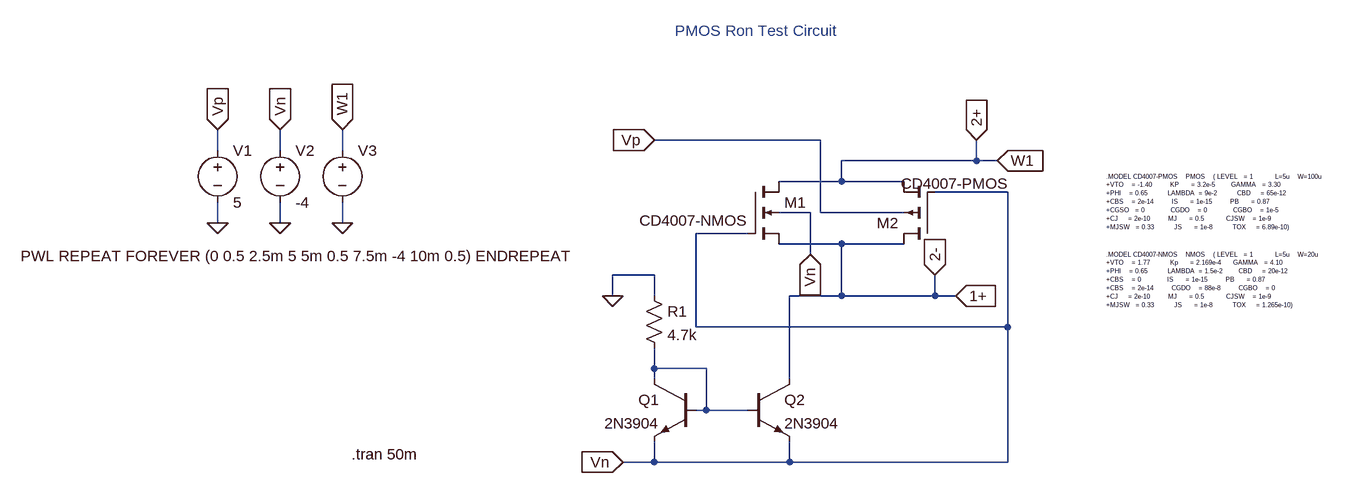
[diagram p0: schematic pmos_ron_test_ltspice.asc]
pmos_ron_test_ltspice.asc, the LTspice schematic file:
Version 4
SHEET 1 1696 680
WIRE 336 -1280 80 -1280
WIRE -592 -1264 -592 -1296
WIRE -496 -1264 -496 -1296
WIRE -400 -1264 -400 -1296
WIRE 576 -1248 576 -1280
WIRE 576 -1248 368 -1248
WIRE 608 -1248 576 -1248
WIRE 368 -1216 368 -1248
WIRE 368 -1216 272 -1216
WIRE 464 -1216 368 -1216
WIRE 624 -1200 512 -1200
WIRE 320 -1168 272 -1168
WIRE 336 -1168 336 -1280
WIRE 464 -1168 336 -1168
WIRE -592 -1152 -592 -1184
WIRE -496 -1152 -496 -1184
WIRE -400 -1152 -400 -1184
WIRE 224 -1136 144 -1136
WIRE 368 -1120 272 -1120
WIRE 464 -1120 368 -1120
WIRE 320 -1104 320 -1168
WIRE 80 -1072 16 -1072
WIRE 16 -1040 16 -1072
WIRE 80 -1040 80 -1072
WIRE 368 -1040 368 -1120
WIRE 368 -1040 288 -1040
WIRE 512 -1040 512 -1072
WIRE 512 -1040 368 -1040
WIRE 544 -1040 512 -1040
WIRE 144 -992 144 -1136
WIRE 624 -992 624 -1200
WIRE 624 -992 144 -992
WIRE 80 -928 80 -960
WIRE 160 -928 80 -928
WIRE 80 -912 80 -928
WIRE 288 -912 288 -1040
WIRE 160 -864 160 -928
WIRE 160 -864 144 -864
WIRE 224 -864 160 -864
WIRE 80 -784 80 -816
WIRE 80 -784 32 -784
WIRE 288 -784 288 -816
WIRE 288 -784 80 -784
WIRE 624 -784 624 -992
WIRE 624 -784 288 -784
FLAG 16 -1040 0
FLAG 80 -1280 Vp
IOPIN 80 -1280 In
FLAG 32 -784 Vn
IOPIN 32 -784 In
FLAG 512 -1072 2-
IOPIN 512 -1072 In
FLAG 544 -1040 1+
IOPIN 544 -1040 In
FLAG 608 -1248 W1
IOPIN 608 -1248 In
FLAG 576 -1280 2+
IOPIN 576 -1280 In
FLAG -592 -1152 0
FLAG -496 -1152 0
FLAG -400 -1152 0
FLAG -592 -1296 Vp
IOPIN -592 -1296 In
FLAG -496 -1296 Vn
IOPIN -496 -1296 In
FLAG -400 -1296 W1
IOPIN -400 -1296 In
FLAG 320 -1104 Vn
IOPIN 320 -1104 In
SYMBOL npn 144 -912 M0
SYMATTR InstName Q1
SYMATTR Value 2N3904
SYMBOL npn 224 -912 R0
SYMATTR InstName Q2
SYMATTR Value 2N3904
SYMBOL res 64 -1056 R0
SYMATTR InstName R1
SYMATTR Value 4.7k
SYMBOL voltage -592 -1280 R0
WINDOW 123 0 0 Left 0
WINDOW 39 0 0 Left 0
SYMATTR InstName V1
SYMATTR Value 5
SYMBOL voltage -496 -1280 R0
WINDOW 123 0 0 Left 0
WINDOW 39 0 0 Left 0
SYMATTR InstName V2
SYMATTR Value -4
SYMBOL voltage -400 -1280 R0
WINDOW 3 -495 179 Left 2
WINDOW 123 0 0 Left 0
WINDOW 39 0 0 Left 0
SYMATTR InstName V3
SYMATTR Value PWL REPEAT FOREVER (0 0.5 2.5m 5 5m 0.5 7.5m -4 10m 0.5) ENDREPEAT
SYMBOL nmos4 224 -1216 R0
WINDOW 3 -167 60 Left 2
SYMATTR InstName M1
SYMATTR Value CD4007-NMOS
SYMBOL pmos4 512 -1120 R180
WINDOW 3 -115 93 Left 2
SYMATTR InstName M2
SYMATTR Value CD4007-PMOS
TEXT 776 -1224 Left 0 !.MODEL CD4007-PMOS    PMOS    ( LEVEL   = 1           L=5u    W=100u                \n+VTO    = -1.40         KP      = 3.2e-5        GAMMA   = 3.30  \n+PHI    = 0.65          LAMBDA  = 9e-2          CBD     = 65e-12\n+CBS    = 2e-14         IS      = 1e-15         PB      = 0.87\n+CGSO   = 0             CGDO    = 0             CGBO    = 1e-5\n+CJ     = 2e-10         MJ      = 0.5           CJSW    = 1e-9\n+MJSW   = 0.33          JS      = 1e-8          TOX     = 6.89e-10)
TEXT 776 -1104 Left 0 !.MODEL CD4007-NMOS    NMOS    ( LEVEL   = 1           L=5u    W=20u             \n+VTO    = 1.77          Kp      = 2.169e-4      GAMMA   = 4.10  \n+PHI    = 0.65          LAMBDA  = 1.5e-2        CBD     = 20e-12\n+CBS    = 0             IS      = 1e-15         PB      = 0.87\n+CBS    = 2e-14         CGDO    = 88e-8         CGBO    = 0\n+CJ     = 2e-10         MJ      = 0.5           CJSW    = 1e-9\n+MJSW   = 0.33          JS      = 1e-8          TOX     = 1.265e-10)
TEXT 112 -1448 Left 2 ;PMOS Ron Test Circuit
TEXT -386 -796 Left 2 !.tran 50m

The netlist it stands for:
* pmos_ron_test_ltspice.asc
Q1 N001 N001 Vn 0 2N3904
Q2 1+ N001 Vn 0 2N3904
R1 0 N001 4.7k
V1 Vp 0 5
V2 Vn 0 -4
V3 2+ 0 PWL REPEAT FOREVER (0 0.5 2.5m 5 5m 0.5 7.5m -4 10m 0.5) ENDREPEAT
M1 2+ Vn 1+ Vn CD4007-NMOS
M2 1+ Vn 2+ Vp CD4007-PMOS
.model NPN NPN
.model PNP PNP
.lib standard.bjt
.model NMOS NMOS
.model PMOS PMOS
.lib standard.mos
.MODEL CD4007-PMOS    PMOS    ( LEVEL   = 1           L=5u    W=100u
+VTO    = -1.40         KP      = 3.2e-5        GAMMA   = 3.30
+PHI    = 0.65          LAMBDA  = 9e-2          CBD     = 65e-12
+CBS    = 2e-14         IS      = 1e-15         PB      = 0.87
+CGSO   = 0             CGDO    = 0             CGBO    = 1e-5
+CJ     = 2e-10         MJ      = 0.5           CJSW    = 1e-9
+MJSW   = 0.33          JS      = 1e-8          TOX     = 6.89e-10)
.MODEL CD4007-NMOS    NMOS    ( LEVEL   = 1           L=5u    W=20u
+VTO    = 1.77          Kp      = 2.169e-4      GAMMA   = 4.10
+PHI    = 0.65          LAMBDA  = 1.5e-2        CBD     = 20e-12
+CBS    = 0             IS      = 1e-15         PB      = 0.87
+CBS    = 2e-14         CGDO    = 88e-8         CGBO    = 0
+CJ     = 2e-10         MJ      = 0.5           CJSW    = 1e-9
+MJSW   = 0.33          JS      = 1e-8          TOX     = 1.265e-10)
* PMOS Ron Test Circuit
.tran 50m
.backanno
.end